# Altium project PLA2216_sonda.PrjPcb
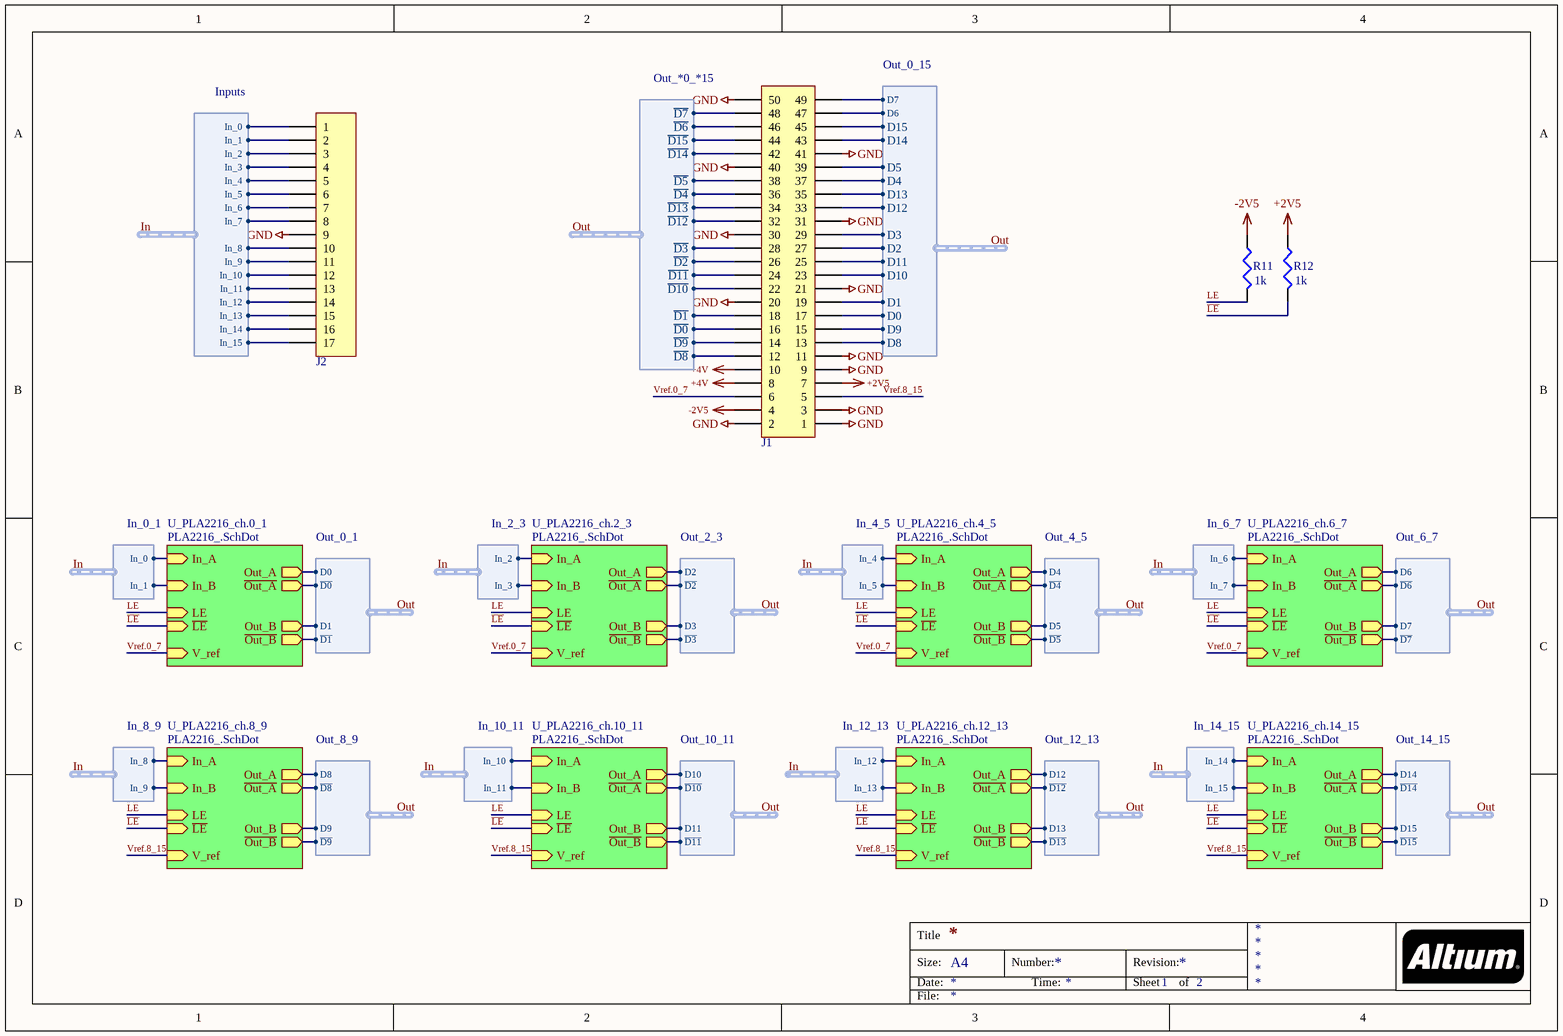
[diagram p0: PLA2216_.SchDoc]
1 sheet, 4 parts. Net scope: hierarchical (ports join the sheet entries above them; power ports are global).
Board file: PLA22116_min._0.254.PcbDoc

## Sheet PLA2216_.SchDoc
size A4; SheetNumber: 1; SheetTotal: 2

### Parts
J1  Header 25X2  [HEADER_25X2]  (value not drawn)
J2  Header 17X1vf  [HEADER_17]  (value not drawn)
R11  1k  [R0402]
R12  1k  [R0402]

### Sub-sheets
U_PLA2216_ch.0_1 = PLA2216_.SchDot (file not in this document): V_ref (in), In_B (in), In_A (in), Out_A (out), ~{Out_A} (out), Out_B (out), ~{Out_B} (out), LE (in), ~{LE} (in)
U_PLA2216_ch.2_3 = PLA2216_.SchDot (file not in this document): V_ref (in), In_B (in), In_A (in), Out_A (out), Out_B (out), LE (in), ~{LE} (in), ~{Out_A} (out), ~{Out_B} (out)
U_PLA2216_ch.4_5 = PLA2216_.SchDot (file not in this document): V_ref (in), In_B (in), In_A (in), Out_A (out), Out_B (out), LE (in), ~{LE} (in), ~{Out_B} (out), ~{Out_A} (out)
U_PLA2216_ch.6_7 = PLA2216_.SchDot (file not in this document): V_ref (in), In_B (in), In_A (in), Out_A (out), Out_B (out), LE (in), ~{LE} (in), ~{Out_A} (out), ~{Out_B} (out)
U_PLA2216_ch.8_9 = PLA2216_.SchDot (file not in this document): V_ref (in), In_B (in), In_A (in), Out_A (out), Out_B (out), LE (in), ~{LE} (in), ~{Out_B} (out), ~{Out_A} (out)
U_PLA2216_ch.10_11 = PLA2216_.SchDot (file not in this document): V_ref (in), In_B (in), In_A (in), Out_A (out), Out_B (out), LE (in), ~{LE} (in), ~{Out_B} (out), ~{Out_A} (out)
U_PLA2216_ch.12_13 = PLA2216_.SchDot (file not in this document): V_ref (in), In_B (in), In_A (in), Out_A (out), Out_B (out), LE (in), ~{LE} (in), ~{Out_A} (out), ~{Out_B} (out)
U_PLA2216_ch.14_15 = PLA2216_.SchDot (file not in this document): V_ref (in), In_B (in), In_A (in), Out_A (out), Out_B (out), LE (in), ~{LE} (in), ~{Out_B} (out), ~{Out_A} (out)

### Harnesses
Inputs: In_0, In_1, In_2, In_3, In_4, In_5, In_6, In_7, In_8, In_9, In_10, In_11, In_12, In_13, In_14, In_15
Out_0_15: D7, D6, D5, D4, D13, D12, D3, D2, D11, D10, D1, D0, D9, D15, D14, D8
Out_*0_*15: ~{D7}, ~{D6}, ~{D15}, ~{D14}, ~{D5}, ~{D4}, ~{D13}, ~{D12}, ~{D3}, ~{D2}, ~{D11}, ~{D10}, ~{D1}, ~{D0}, ~{D9}, ~{D8}
In_0_1: In_0, In_1
In_2_3: In_2, In_3
In_4_5: In_4, In_5
In_6_7: In_6, In_7
In_8_9: In_8, In_9
In_10_11: In_10, In_11
In_12_13: In_12, In_13
In_14_15: In_14, In_15
Out_0_1: D0, ~{D0}, D1, ~{D1}
Out_2_3: D2, D3, ~{D2}, ~{D3}
Out_4_5: D4, D5, ~{D4}, ~{D5}
Out_6_7: D6, D7, ~{D6}, ~{D7}
Out_8_9: D8, D9, ~{D8}, ~{D9}
Out_10_11: D10, D11, ~{D10}, ~{D11}
Out_12_13: D12, D13, ~{D12}, ~{D13}
Out_14_15: D14, D15, ~{D14}, ~{D15}

### Nets
+2V5: J1.7 R12.1
+4V: J1.8 J1.10
-2V5: J1.4 R11.1
GND: J1.1 J1.2 J1.3 J1.9 J1.11 J1.20 J1.21 J1.30 J1.31 J1.40 J1.41 J1.50 J2.9
In.In_0: J2.1 ; sheet U_PLA2216_ch.0_1/In_A, harness Inputs.In_0, harness In_0_1.In_0
In.In_1: J2.2 ; sheet U_PLA2216_ch.0_1/In_B, harness Inputs.In_1, harness In_0_1.In_1
In.In_2: J2.3 ; sheet U_PLA2216_ch.2_3/In_A, harness Inputs.In_2, harness In_2_3.In_2
In.In_3: J2.4 ; sheet U_PLA2216_ch.2_3/In_B, harness Inputs.In_3, harness In_2_3.In_3
In.In_4: J2.5 ; sheet U_PLA2216_ch.4_5/In_A, harness Inputs.In_4, harness In_4_5.In_4
In.In_5: J2.6 ; sheet U_PLA2216_ch.4_5/In_B, harness Inputs.In_5, harness In_4_5.In_5
In.In_6: J2.7 ; sheet U_PLA2216_ch.6_7/In_A, harness Inputs.In_6, harness In_6_7.In_6
In.In_7: J2.8 ; sheet U_PLA2216_ch.6_7/In_B, harness Inputs.In_7, harness In_6_7.In_7
In.In_8: J2.10 ; sheet U_PLA2216_ch.8_9/In_A, harness Inputs.In_8, harness In_8_9.In_8
In.In_9: J2.11 ; sheet U_PLA2216_ch.8_9/In_B, harness Inputs.In_9, harness In_8_9.In_9
In.In_10: J2.12 ; sheet U_PLA2216_ch.10_11/In_A, harness Inputs.In_10, harness In_10_11.In_10
In.In_11: J2.13 ; sheet U_PLA2216_ch.10_11/In_B, harness Inputs.In_11, harness In_10_11.In_11
In.In_12: J2.14 ; sheet U_PLA2216_ch.12_13/In_A, harness Inputs.In_12, harness In_12_13.In_12
In.In_13: J2.15 ; sheet U_PLA2216_ch.12_13/In_B, harness Inputs.In_13, harness In_12_13.In_13
In.In_14: J2.16 ; sheet U_PLA2216_ch.14_15/In_A, harness Inputs.In_14, harness In_14_15.In_14
In.In_15: J2.17 ; sheet U_PLA2216_ch.14_15/In_B, harness Inputs.In_15, harness In_14_15.In_15
~{LE}: R12.2 ; sheet U_PLA2216_ch.0_1/~{LE}, sheet U_PLA2216_ch.8_9/~{LE}, sheet U_PLA2216_ch.2_3/~{LE}, sheet U_PLA2216_ch.4_5/~{LE}, sheet U_PLA2216_ch.6_7/~{LE}, sheet U_PLA2216_ch.10_11/~{LE}, sheet U_PLA2216_ch.12_13/~{LE}, sheet U_PLA2216_ch.14_15/~{LE}
LE: R11.2 ; sheet U_PLA2216_ch.0_1/LE, sheet U_PLA2216_ch.8_9/LE, sheet U_PLA2216_ch.2_3/LE, sheet U_PLA2216_ch.4_5/LE, sheet U_PLA2216_ch.6_7/LE, sheet U_PLA2216_ch.10_11/LE, sheet U_PLA2216_ch.12_13/LE, sheet U_PLA2216_ch.14_15/LE
Out~{.}D0: J1.16 ; sheet U_PLA2216_ch.0_1/~{Out_A}, harness Out_*0_*15.~{D0}, harness Out_0_1.~{D0}
Out~{.}D1: J1.18 ; sheet U_PLA2216_ch.0_1/~{Out_B}, harness Out_*0_*15.~{D1}, harness Out_0_1.~{D1}
Out~{.}D2: J1.26 ; sheet U_PLA2216_ch.2_3/~{Out_A}, harness Out_*0_*15.~{D2}, harness Out_2_3.~{D2}
Out~{.}D3: J1.28 ; sheet U_PLA2216_ch.2_3/~{Out_B}, harness Out_*0_*15.~{D3}, harness Out_2_3.~{D3}
Out~{.}D4: J1.36 ; sheet U_PLA2216_ch.4_5/~{Out_A}, harness Out_*0_*15.~{D4}, harness Out_4_5.~{D4}
Out~{.}D5: J1.38 ; sheet U_PLA2216_ch.4_5/~{Out_B}, harness Out_*0_*15.~{D5}, harness Out_4_5.~{D5}
Out~{.}D6: J1.46 ; sheet U_PLA2216_ch.6_7/~{Out_A}, harness Out_*0_*15.~{D6}, harness Out_6_7.~{D6}
Out~{.}D7: J1.48 ; sheet U_PLA2216_ch.6_7/~{Out_B}, harness Out_*0_*15.~{D7}, harness Out_6_7.~{D7}
Out~{.}D8: J1.12 ; sheet U_PLA2216_ch.8_9/~{Out_A}, harness Out_*0_*15.~{D8}, harness Out_8_9.~{D8}
Out~{.}D9: J1.14 ; sheet U_PLA2216_ch.8_9/~{Out_B}, harness Out_*0_*15.~{D9}, harness Out_8_9.~{D9}
Out~{.}D10: J1.22 ; sheet U_PLA2216_ch.10_11/~{Out_A}, harness Out_*0_*15.~{D10}, harness Out_10_11.~{D10}
Out~{.}D11: J1.24 ; sheet U_PLA2216_ch.10_11/~{Out_B}, harness Out_*0_*15.~{D11}, harness Out_10_11.~{D11}
Out~{.}D12: J1.32 ; sheet U_PLA2216_ch.12_13/~{Out_A}, harness Out_*0_*15.~{D12}, harness Out_12_13.~{D12}
Out~{.}D13: J1.34 ; sheet U_PLA2216_ch.12_13/~{Out_B}, harness Out_*0_*15.~{D13}, harness Out_12_13.~{D13}
Out~{.}D14: J1.42 ; sheet U_PLA2216_ch.14_15/~{Out_A}, harness Out_*0_*15.~{D14}, harness Out_14_15.~{D14}
Out~{.}D15: J1.44 ; sheet U_PLA2216_ch.14_15/~{Out_B}, harness Out_*0_*15.~{D15}, harness Out_14_15.~{D15}
Out.D0: J1.17 ; sheet U_PLA2216_ch.0_1/Out_A, harness Out_0_15.D0, harness Out_0_1.D0
Out.D1: J1.19 ; sheet U_PLA2216_ch.0_1/Out_B, harness Out_0_15.D1, harness Out_0_1.D1
Out.D2: J1.27 ; sheet U_PLA2216_ch.2_3/Out_A, harness Out_0_15.D2, harness Out_2_3.D2
Out.D3: J1.29 ; sheet U_PLA2216_ch.2_3/Out_B, harness Out_0_15.D3, harness Out_2_3.D3
Out.D4: J1.37 ; sheet U_PLA2216_ch.4_5/Out_A, harness Out_0_15.D4, harness Out_4_5.D4
Out.D5: J1.39 ; sheet U_PLA2216_ch.4_5/Out_B, harness Out_0_15.D5, harness Out_4_5.D5
Out.D6: J1.47 ; sheet U_PLA2216_ch.6_7/Out_A, harness Out_0_15.D6, harness Out_6_7.D6
Out.D7: J1.49 ; sheet U_PLA2216_ch.6_7/Out_B, harness Out_0_15.D7, harness Out_6_7.D7
Out.D8: J1.13 ; sheet U_PLA2216_ch.8_9/Out_A, harness Out_0_15.D8, harness Out_8_9.D8
Out.D9: J1.15 ; sheet U_PLA2216_ch.8_9/Out_B, harness Out_0_15.D9, harness Out_8_9.D9
Out.D10: J1.23 ; sheet U_PLA2216_ch.10_11/Out_A, harness Out_0_15.D10, harness Out_10_11.D10
Out.D11: J1.25 ; sheet U_PLA2216_ch.10_11/Out_B, harness Out_0_15.D11, harness Out_10_11.D11
Out.D12: J1.33 ; sheet U_PLA2216_ch.12_13/Out_A, harness Out_0_15.D12, harness Out_12_13.D12
Out.D13: J1.35 ; sheet U_PLA2216_ch.12_13/Out_B, harness Out_0_15.D13, harness Out_12_13.D13
Out.D14: J1.43 ; sheet U_PLA2216_ch.14_15/Out_A, harness Out_0_15.D14, harness Out_14_15.D14
Out.D15: J1.45 ; sheet U_PLA2216_ch.14_15/Out_B, harness Out_0_15.D15, harness Out_14_15.D15
Vref.0_7: J1.6 ; sheet U_PLA2216_ch.0_1/V_ref, sheet U_PLA2216_ch.2_3/V_ref, sheet U_PLA2216_ch.4_5/V_ref, sheet U_PLA2216_ch.6_7/V_ref
Vref.8_15: J1.5 ; sheet U_PLA2216_ch.8_9/V_ref, sheet U_PLA2216_ch.10_11/V_ref, sheet U_PLA2216_ch.12_13/V_ref, sheet U_PLA2216_ch.14_15/V_ref

### Notes on the sheet
- Title
- Size:
- Date:
- A4
- Number:
- Time:
- Revision:
- Sheet
- of
- File:

### Library data of the parts
J1 = SBH11-PBPC-D25-ST-BK: 50 Position Total Dual Row 2.54 mm Pitch Straight Male Shrouded Box Header; Manufacturer: Sullins; RoHS: Yes; Stock 1: 10015; Pricing 1: 1=1,03, 10=0,867, 80=0,77875, 440=0,63718, 1000=0,56638, 5000=0,5057 (USD); ComponentLink1URL: https://datasheet.ciiva.com/730/sbh11-pbpc-dxx-st-xx-730923.pdf?src-supplier=Digikey; ComponentLink1Description: https://datasheet.ciiva.com/730/sbh11-pbpc-dxx-st-xx-730923.pdf?src-supplier=Digikey; Supplier 1: Digikey; Supplier Part Number 1: S9176-ND; Manufacturer Part Number: SBH11-PBPC-D25-ST-BK; Category: Headers and Wire Housings
J2 = PH1RB-17-UA: Conn Unshrouded Header HDR 17 POS 2.54mm Solder RA Thru-Hole; Manufacturer: Adam Equipment; RoHS: No; Stock 1: 418; Pricing 1: 1=0,39, 10=0,33, 100=0,2569 (USD); Supplier 1: Digikey; Supplier Part Number 1: 2057-PH1RB-17-UA-ND; Manufacturer Part Number: PH1RB-17-UA; Category: Connectors
R11 R12 = CR0805-FX-1001ELF: Resistor Thick Film 0805 1k Ohm 1% 1/8 Watt ±100ppm °C Surface Mount Paper Tape On Plastic Reel; Manufacturer: Bourns; Resistance: 1kR; Power Rating: 125mW; Voltage Rating: 150V; Temperature Coefficient: 100ppm/°C; RoHS: Yes; Stock 1: 447747; Pricing 1: 1=0,1, 10=0,021, 50=0,0132, 100=0,011, 500=0,00744, 1000=0,00639 (USD); Mount: Surface Mount; Case/Package: 0805; Number of Pins: 2; Case Code (Imperial): 0805; Case Code (Metric): 2012; Contact Plating: Tin; Min Operating Temperature: -55°C; Max Operating Temperature: 155°C; Packaging: Tape and Reel; Tolerance: 1%; Package Quantity: 5000; Resistor Type: Thick Film; Termination: SMD/SMT; Number of Terminations: 2; Max Power Dissipation: 125mW; Voltage Rating (DC): 150V; Features: Moisture Resistant; Series: CR0805; Resistance Tolerance: 1%; Technology: THICK FILM; Length: 2mm; Width: 1.25mm; Height: 0.5mm; Depth: 1.25mm; Thickness: 508um; Radiation Hardening: No; Reach SVHC Compliant: No; RoHS Compliant: Yes; ComponentLink1URL: https://datasheet.ciiva.com/11810/0900766b80fcdb72-11810305.pdf?src-supplier=Rs; ComponentLink1Description: https://datasheet.ciiva.com/11810/0900766b80fcdb72-11810305.pdf?src-supplier=Rs; ComponentLink2URL: https://datasheet.ciiva.com/27049/775383-27049976.pdf?src-supplier=Jameco; ComponentLink2Description: https://datasheet.ciiva.com/27049/775383-27049976.pdf?src-supplier=Jameco; ComponentLink3URL: https://datasheet.ciiva.com/7986/1856384-7986222.pdf?src-supplier=Element14; ComponentLink3Description: https://datasheet.ciiva.com/7986/1856384-7986222.pdf?src-supplier=Element14; ComponentLink4URL: https://datasheet.ciiva.com/46394/691949-46394380.pdf?src-supplier=Element14; ComponentLink4Description: https://datasheet.ciiva.com/46394/691949-46394380.pdf?src-supplier=Element14; ComponentLink5URL: https://datasheet.ciiva.com/16722/70154685-16722677.pdf?src-supplier=Allied+Electronics; ComponentLink5Description: https://datasheet.ciiva.com/16722/70154685-16722677.pdf?src-supplier=Allied+Electronics; ComponentLink6URL: https://datasheet.ciiva.com/9123/chpreztr-9123643.pdf?src-supplier=Avnet; ComponentLink6Description: https://datasheet.ciiva.com/9123/chpreztr-9123643.pdf?src-supplier=Avnet; ComponentLink7URL: https://datasheet.ciiva.com/48692/001055506-da-01-en-smd-wid-cr0805-fx-1001elf-1k-ohm-1-8w-48692106.pdf?src-supplier=Conrad; ComponentLink7Description: https://datasheet.ciiva.com/48692/001055506-da-01-en-smd-wid-cr0805-fx-1001elf-1k-ohm-1-8w-48692106.pdf?src-supplier=Conrad; Supplier 1: Digikey; Supplier Part Number 1: CR0805-FX-1001ELFCT-ND; Manufacturer Part Number: CR0805-FX-1001ELF; Category: Chip SMD Resistors